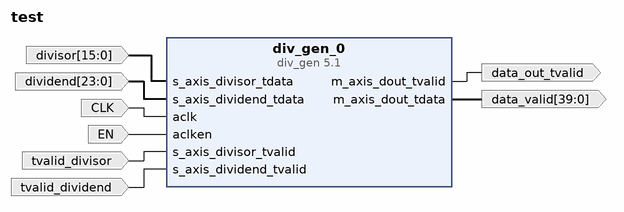
[diagram p0: block diagram of the top level]
# Vivado block design test, xc7z020clg400-1, Vivado 2018.2.2
create_bd_design test

create_bd_port -dir I -from 15 -to 0 divisor
create_bd_port -dir I -from 23 -to 0 dividend
create_bd_port -dir I -type clk CLK
create_bd_port -dir I EN
create_bd_port -dir O -from 39 -to 0 data_valid
create_bd_port -dir O data_out_tvalid
create_bd_port -dir I tvalid_divisor
create_bd_port -dir I tvalid_dividend

create_bd_cell -type ip -vlnv xilinx.com:ip:div_gen:5.1 div_gen_0
set_property -dict [list \
  CONFIG.dividend_and_quotient_width 18 \
  CONFIG.divisor_width 11 \
  CONFIG.fractional_width 11 \
  CONFIG.latency 22 \
  CONFIG.ACLKEN true \
] [get_bd_cells div_gen_0]

# ---- connections ----

connect_bd_net [get_bd_ports divisor] [get_bd_pins div_gen_0/s_axis_divisor_tdata]
connect_bd_net [get_bd_ports dividend] [get_bd_pins div_gen_0/s_axis_dividend_tdata]
connect_bd_net [get_bd_ports CLK] [get_bd_pins div_gen_0/aclk]
connect_bd_net [get_bd_pins div_gen_0/m_axis_dout_tdata] [get_bd_ports data_valid]
connect_bd_net [get_bd_pins div_gen_0/m_axis_dout_tvalid] [get_bd_ports data_out_tvalid]
connect_bd_net [get_bd_ports EN] [get_bd_pins div_gen_0/aclken]
connect_bd_net [get_bd_ports tvalid_divisor] [get_bd_pins div_gen_0/s_axis_divisor_tvalid]
connect_bd_net [get_bd_ports tvalid_dividend] [get_bd_pins div_gen_0/s_axis_dividend_tvalid]

validate_bd_design
save_bd_design
